# Altium schematic sheet Sheet3.SchDoc
size A3; SheetNumber: 1; SheetTotal: 1
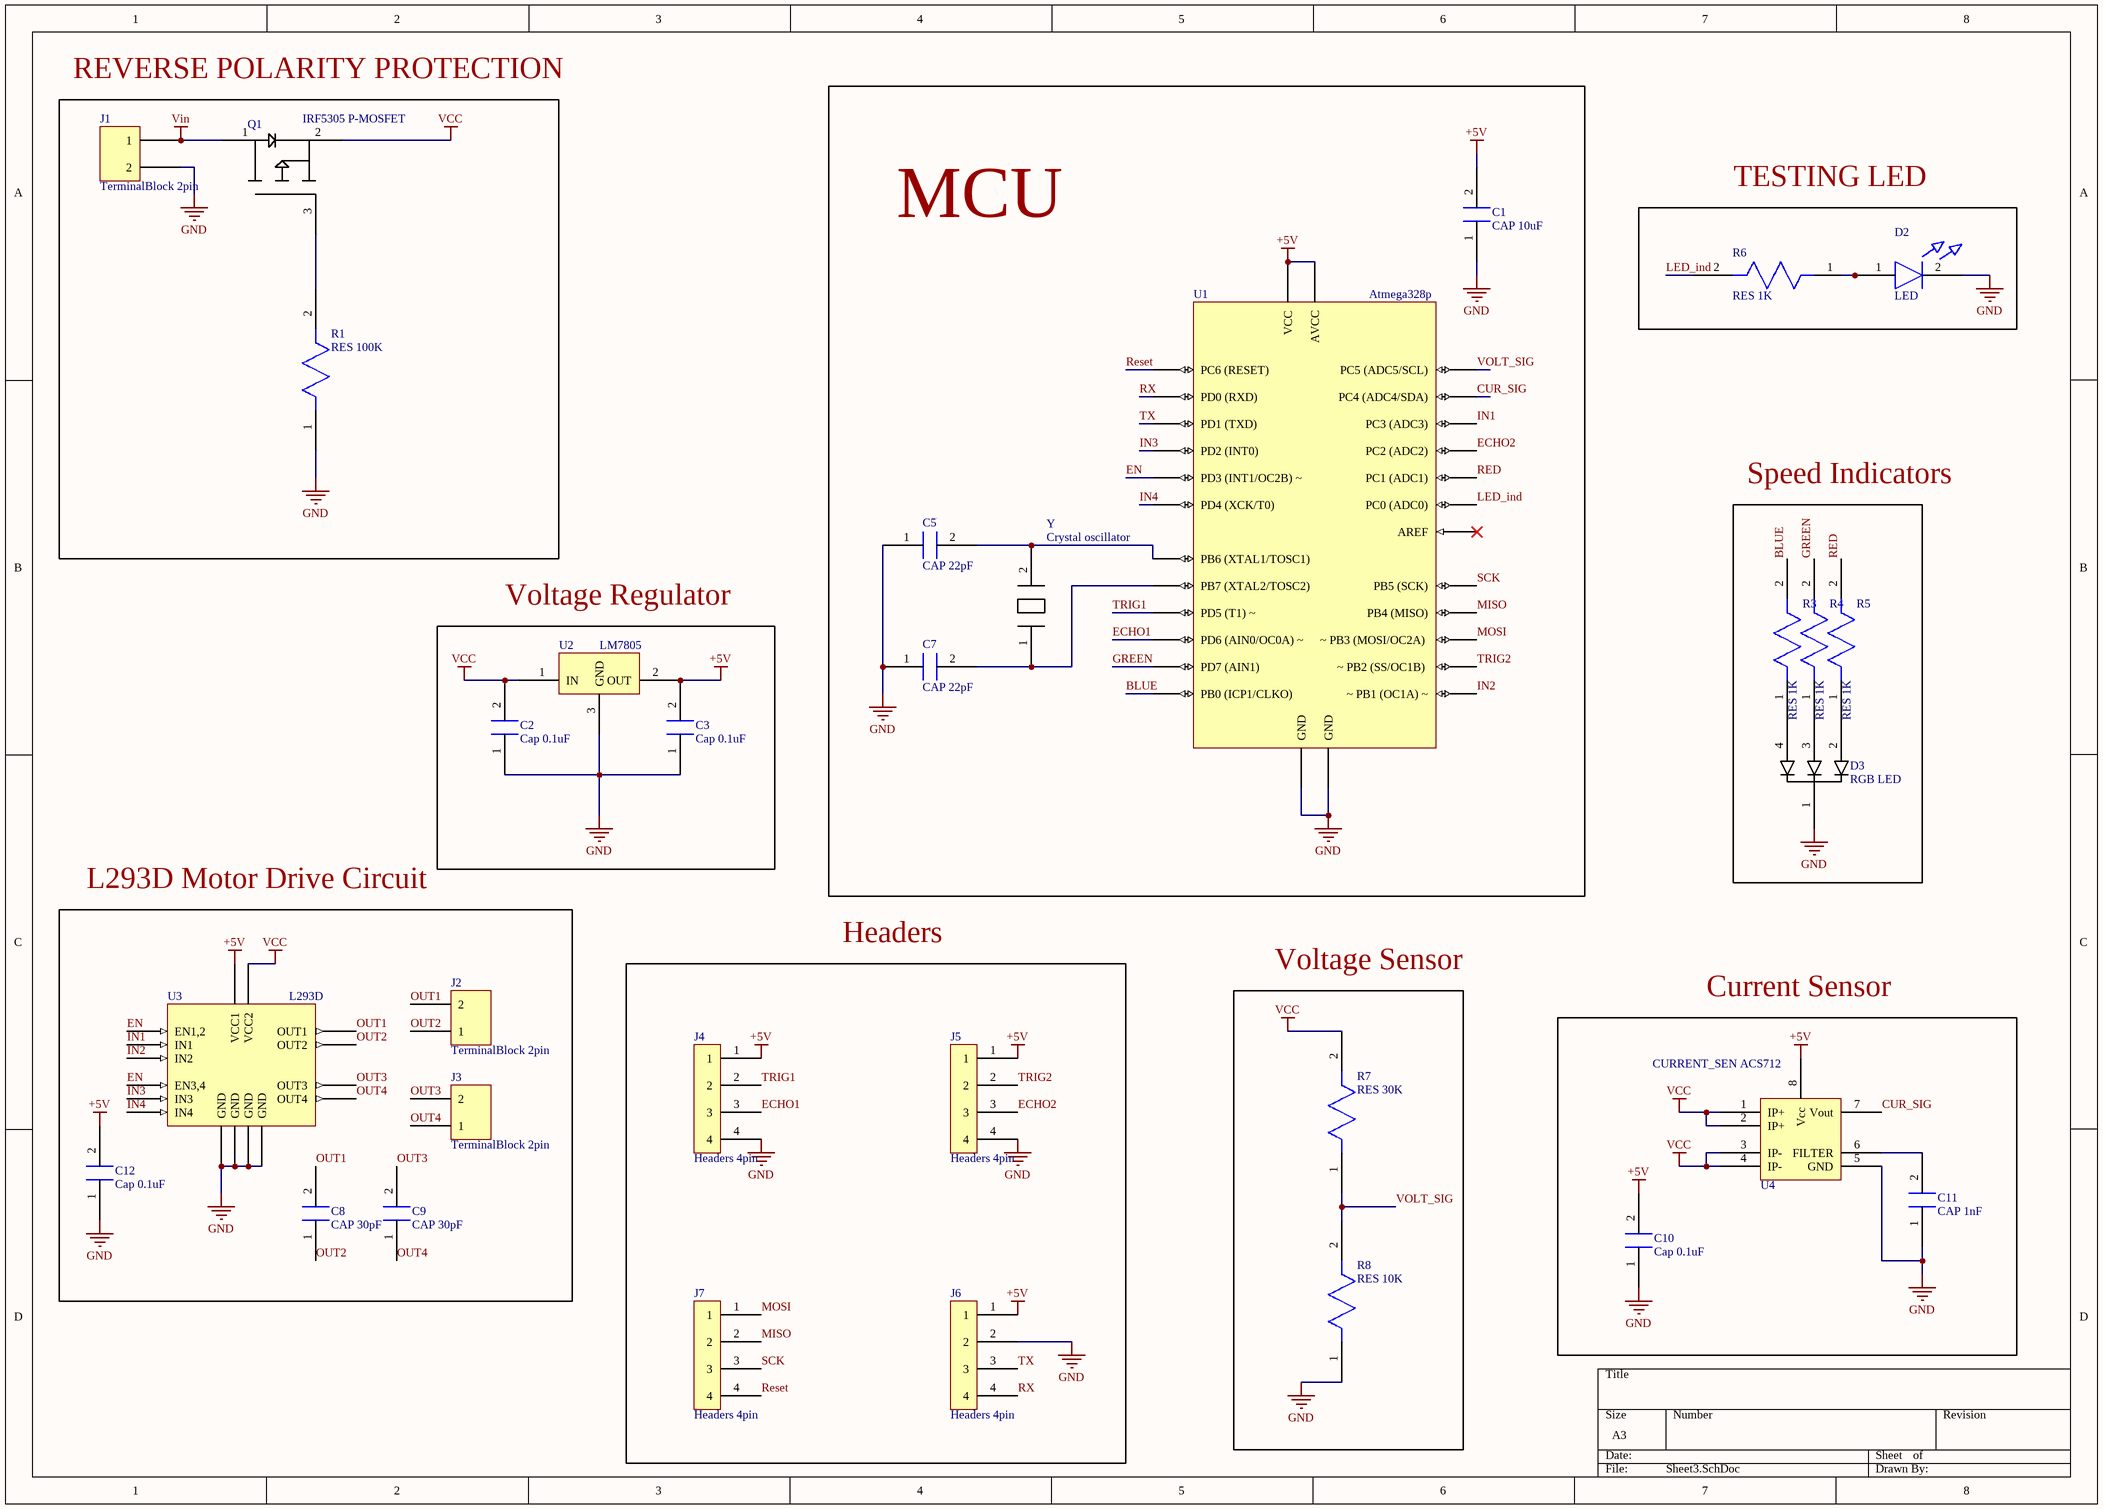
[diagram p0: Sheet3.SchDoc]

## Parts
C1  CAP 10uF  [Cap 10uF]
C2  Cap 0.1uF  [CAP 0.1uF]
C3  Cap 0.1uF  [CAP 0.1uF]
C5  CAP 22pF  [Cap 22pF]
C7  CAP 22pF  [Cap 22pF]
C8  CAP 30pF  [CAP 30pF]
C9  CAP 30pF  [CAP 30pF]
C10  Cap 0.1uF  [CAP 0.1uF]
C11  CAP 1nF  [CAP 1nF]
C12  Cap 0.1uF  [CAP 0.1uF]
D2  LED  [LED]
D3  RGB LED  [RGB LED]
J1  TerminalBlock 2pin  [Terminal Block 2pin]
J2  TerminalBlock 2pin  [Terminal Block 2pin]
J3  TerminalBlock 2pin  [Terminal Block 2pin]
J4  Headers 4pin  [Header 4pin]
J5  Headers 4pin  [Header 4pin]
J6  Headers 4pin  [Header 4pin]
J7  Headers 4pin  [Header 4pin]
Q1  IRF5305 P-MOSFET  [IRF5305]
R1  RES 100K  [Res100K]
R3  RES 1K  [Res 1K]
R4  RES 1K  [Res 1K]
R5  RES 1K  [Res 1K]
R6  RES 1K  [Res 1K]
R7  RES 30K  [Res100K]
R8  RES 10K  [Res10K]
U1  Atmega328p  [ATMega 328 P-PU - duplicate]
U2  LM7805  [LM7805]
U3  L293D  [L293D]
U4  CURRENT_SEN ACS712  [Cuurent_sens]
Y  Crystal oscillator  [Crrystal 16MHZ]

## Blocks framed on the sheet
REVERSE POLARITY PROTECTION: J1 Q1 R1
MCU: C1 C5 C7 U1 Y
TESTING LED: D2 R6
Speed Indicators: D3 R3-R5
Voltage Regulator: C2 C3 U2
L293D Motor Drive Circuit: C8 C9 C12 J2 J3 U3
Headers: J4-J7
Voltage Sensor: R7 R8
Current Sensor: C10 C11 U4

## Nets
+5V: C1.2 C3.2 C10.2 C12.2 J4.1 J5.1 J6.1 U1.7(VCC) U1.20(AVCC) U2.2(OUT) U3.16(VCC1) U4.8(Vcc)
GND: C1.1 C2.1 C3.1 C5.1 C7.1 C10.1 C11.1 C12.1 D2.2 D3.1((-)) J1.2 J4.4 J5.4 J6.2 R1.1 R8.1 U1.8(GND) U1.22(GND) U2.3(GND) U3.4(GND) U3.5(GND) U3.12(GND) U3.13(GND) U4.5(GND)
VCC: C2.2 Q1.2(S) R7.2 U2.1(IN) U3.8(VCC2) U4.1(IP+) U4.2(IP+) U4.3(IP-) U4.4(IP-)
Vin: J1.1 Q1.1(D)
BLUE: R3.2 U1.14(PB0_(ICP1/CLKO))
CUR_SIG: U1.27(PC4_(ADC4/SDA)) U4.7(Vout)
ECHO1: J4.3 U1.12(PD6_(AIN0/OC0A)_~)
ECHO2: J5.3 U1.25(PC2_(ADC2))
EN: U1.5(PD3_(INT1/OC2B)_~) U3.1(EN1,2) U3.9(EN3,4)
GREEN: R4.2 U1.13(PD7_(AIN1))
IN1: U1.26(PC3_(ADC3)) U3.2(IN1)
IN2: U1.15(~_PB1_(OC1A)_~) U3.7(IN2)
IN3: U1.4(PD2_(INT0)) U3.10(IN3)
IN4: U1.6(PD4_(XCK/T0)) U3.15(IN4)
LED_ind: R6.2 U1.23(PC0_(ADC0))
MISO: J7.2 U1.18(PB4_(MISO))
MOSI: J7.1 U1.17(~_PB3_(MOSI/OC2A))
OUT1: C8.2 J2.2 U3.3(OUT1)
OUT2: C8.1 J2.1 U3.6(OUT2)
OUT3: C9.2 J3.2 U3.11(OUT3)
OUT4: C9.1 J3.1 U3.14(OUT4)
RED: R5.2 U1.24(PC1_(ADC1))
Reset: J7.4 U1.1(PC6_(RESET))
RX: J6.4 U1.2(PD0_(RXD))
SCK: J7.3 U1.19(PB5_(SCK))
TRIG1: J4.2 U1.11(PD5_(T1)_~)
TRIG2: J5.2 U1.16(~_PB2_(SS/OC1B))
TX: J6.3 U1.3(PD1_(TXD))
VOLT_SIG: R7.1 R8.2 U1.28(PC5_(ADC5/SCL))
NetC5_2: C5.2 U1.9(PB6_(XTAL1/TOSC1)) Y.2
NetC7_2: C7.2 U1.10(PB7_(XTAL2/TOSC2)) Y.1
NetC11_2: C11.2 U4.6(FILTER)
NetD2_1: D2.1 R6.1
NetD3_2: D3.2(R) R5.1
NetD3_3: D3.3(G) R4.1
NetD3_4: D3.4(B) R3.1
NetQ1_3: Q1.3(G) R1.2

Not connected (* = marked no-connect by the designer): U1 21(AREF)*

## Library data of the parts
R7 = RES 100K
U4 = CURRENT_MOD ACS712
J1-J3 = TerminalBlock 2pin: Mfr number: *; Parameter 2: *; Parameter 3: *; Parameter 4: *